# EAGLE schematic Analog Board (EAGLE 9.5.0)
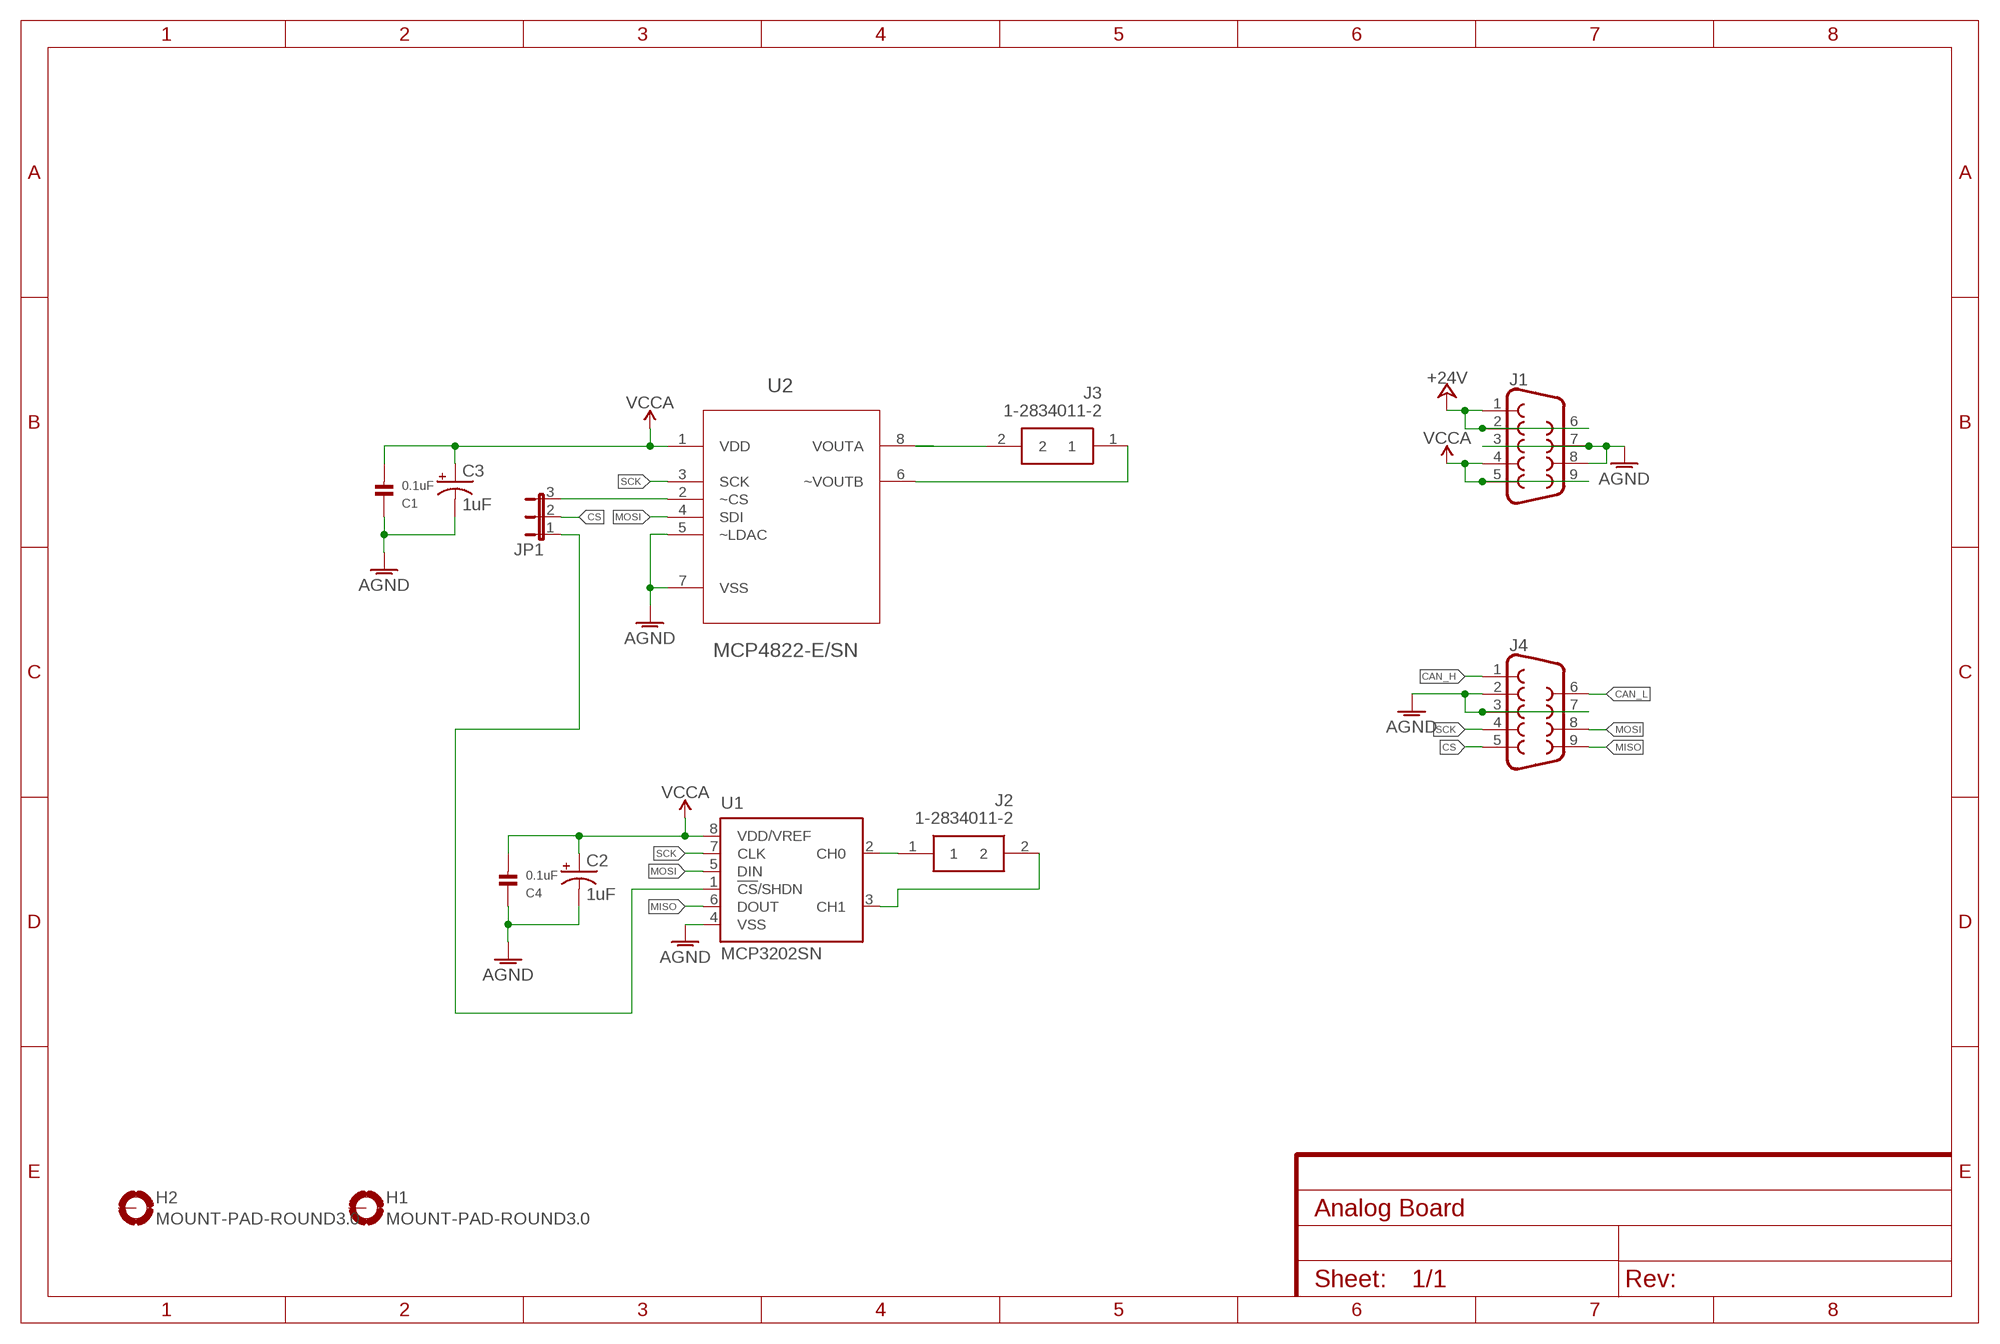
[diagram p0: schematic, sheet 1]

## Parts
C1  0.1uF  CAP_CERAMIC0805-NOTHERMALS  [0805_NOTHERMALS]
C2  1uF  CPOL-USB  [PANASONIC_B]
C3  1uF  CPOL-USB  [PANASONIC_B]
C4  0.1uF  CAP_CERAMIC0805-NOTHERMALS  [0805_NOTHERMALS]
H1  MOUNT-PAD-ROUND3.0  [3,0-PAD]
H2  MOUNT-PAD-ROUND3.0  [3,0-PAD]
J1  DB9FEMALE  [DB9]
J2  1-2834011-2  [128340112]
J3  1-2834011-2  [128340112]
J4  DB9FEMALE  [DB9]
JP1  JP2W  [JP2W]
U1  MCP3202SN  [SO-08]
U2  MCP4822-E/SN  [SOIC8-N_MC]

## Nets
+24V: J1.1 J1.2 J1.6
AGND: C1.1 C2.- C3.- C4.1 J1.3 J1.7 J1.8 J4.2 J4.3 J4.7 U1.4(VSS) U2.5(~LDAC) U2.7(VSS)
CAN_H: J4.1
CAN_L: J4.6
CS: J4.5 JP1.2
MISO: J4.9 U1.6(DOUT)
MOSI: J4.8 U1.5(DIN) U2.4(SDI)
N$1: JP1.3 U2.2(~CS)
N$2: JP1.1 U1.1(!CS!/SHDN)
N$3: J3.2 U2.8(VOUTA)
N$4: J3.1 U2.6(~VOUTB)
N$5: J2.1 U1.2(CH0)
N$7: J2.2 U1.3(CH1)
SCK: J4.4 U1.7(CLK) U2.3(SCK)
VCCA: C1.2 C2.+ C3.+ C4.2 J1.4 J1.5 J1.9 U1.8(VDD/VREF) U2.1(VDD)
Unconnected: H1.B3,0(MOUNT) H2.B3,0(MOUNT)

## Library data of the parts
C1 C4 = microbuilder:CAP_CERAMIC: Ceramic Capacitors 0402 - 0402 Surface Mount Capacitors 16pF 50V 5% [Digikey: 445-4899-2-ND] 18pF 50V 5% [Digikey: 490-1281-2-ND] 22pF 50V 5% [Digikey: 490-1283-2-ND] 68pF 50V 5% [Digikey: 490-1289-2-ND] 0.1uF 10V 10% [Digikey: 490-1318-2-ND] 1.0uF 6.3V 10% [Digikey: 490-1320-2-ND] 0603 - 0603 Surface Mount Capacitors 16 pF 50V 5% [Digikey: 445-5051-2-ND] 22 pF 50V [Digikey: PCC220ACVTR-ND] 33 pF 50V 5% [Digikey: 490-1415-1-ND] 56pF 50V 5% [Digikey: 490-1421-1-ND] 220pF 50V 5% [Digikey: 445-1285-1-ND] 680 pF 50V 2200 pF 50V 5% C0G [Digikey: 445-1297-1-ND] 5600 pF 100V 5% X7R [Digikey: 478-3711-1-ND] 0.1 µF 25V 10% [Digikey: PCC2277TR-ND] 0.22 µF 16V 10% X7R [Digikey: 445-1318-1-ND] 1.0 µF 25V 10% [Digikey: 445-5146-2-ND] 0603 - RF Specific 3pF 250V +/-0.1pF RF [Digikey: 712-1347-1-ND] 18 pF 250V 5% [Digikey: 478-3505-1-ND or 712-1322-1-ND] 56 pF 250V 5% C0G RF [Digikey: 490-4867-1-ND] 68 pF 250V RF [Digikey: 490-4868-1-ND] 0805 - 0805 Surface Mount Capacitors 220 pF 250V 2% RF Ceramic Capacitor [Digikey: 712-1398-1-ND] 1000 pF 50V 2% NP0 Ceramic Capacitor [Digikey: 478-3760-1-ND] 0.1 µF 25V 10% Ceramic Capacitor [Digikey: PCC1828TR-ND] 1.0 µF 16V 10% Ceramic Capacitor[Digikey: 490-1691-2-ND] 10.0 µF 10V 10% Ceramic Capacitor[Digikey: 709-1228-1-ND] 10.0 uF 16V 10% Ceramic Capacitor [Digikey: 478-5165-2-ND] 47 uF 6.3V 20% Ceramic Capacitor [Digikey: 587-1779-1-ND or 399-5506-1-ND] 1206 - 1206 Surface Mount Capacitors 47uF 10V 20% Ceramic Capacitor [Digikey: 490-5528-1-ND or 399-5508-1-ND or 445-6010-1-ND] 100uF 6.3V -20%, +80% Y5V Ceramic Capacitor (Digikey: 490-4512-1-ND, Mouser: 81-GRM31CF50J107ZE1L)
C2 C3 = adafruit:CPOL-US: POLARIZED CAPACITOR, American symbol
H1 H2 = holes:MOUNT-PAD-ROUND: MOUNTING PAD, round
J1 J4 = SparkFun-Connectors:DB9: DB9 Connector Standard DB9 (D-Sub 9) serial connector. Can be used for CAN bus as well as RS485 and RS232. Footprint production proven. Here is the female version connector we sell at SparkFun: 9 Pin Female Serial Connector - PCB Mount <https://www.sparkfun.com/products/429> (PRT-00429) This connector has been used on the following SparkFun products: SparkFun RS232 Shifter - SMD <https://www.sparkfun.com/products/449> (PRT-00449) SparkFun RS232 Shifter SMD (No DB9) <https://www.sparkfun.com/products/8780> (PRT-08780); PROD_ID: CONN-08194
J2 J3 = 1-2834011-2:1-2834011-2: 2P 3.5mm Top Entry Screwless Connector. TE Connectivity 3.5mm Pitch Vertical PCB Terminal Block with Solder Termination, Through Hole, 2 Way Source: Datasheet <http://www.te.com/commerce/DocumentDelivery/DDEController?Action=showdoc&DocId=Customer Drawing2834011BpdfEnglishENG_CD_2834011_B.pdf1-2834011-2>; ARROW_PART_NUMBER: 1-2834011-2; ARROW_PRICE/STOCK: https://www.arrow.com/en/products/1-2834011-2/te-connectivity; DESCRIPTION: 2P 3.5mm Top Entry Screwless Connector. TE Connectivity 3.5mm Pitch Vertical PCB Terminal Block with Solder Termination, Through Hole, 2 Way; HEIGHT: 11mm; MANUFACTURER_NAME: TE Connectivity; MANUFACTURER_PART_NUMBER: 1-2834011-2; RS_PART_NUMBER: 1649131; RS_PRICE/STOCK: http://uk.rs-online.com/web/p/products/1649131
JP1 = jumper:JP2W: JUMPER
U1 = microchip:MCP3202: 2.7V Dual Channel 12-Bit A/D Converter with SPI Serial Interface Source: http://ww1.microchip.com/downloads/en/DeviceDoc/21034D.pdf; MF: MICROCHIP; MPN: MCP3202-CI/SN; OC_FARNELL: 1196803; OC_NEWARK: 19C7207
U2 = MCP4822-E_SN:MCP4822-E/SN: 12 Bit DAC; AVAILABILITY: Unavailable; DESCRIPTION: MCP4822 Series 2 Ch 12-Bit Voltage Output Digital-to-Analog Converter-SOIC-8; MF: Microchip; MP: MCP4822-E/SN; PACKAGE: SOIC-8 Microchip; PRICE: None